# Altium schematic sheet PSDT Controller v1.0.0.SchDoc: Probe-Scope Digital Test: Controller
size Tabloid; CompanyName: Probe-Scope; Organization: Probe-Scope; Address1: Probe-Scope: Unified USB; Address2: Oscilloscope Probe; Address3: ©2019 M. Omo, J. Rowley,; Address4: K. Hall, released under the; DocumentNumber: SCH0020; SheetNumber: 1; PageSetup: Record=PageOptions|CenterHorizontal=True|CenterVertical=True|PrintScale=0.96|XCorrection=1.00|YCorrection=1.00|PrintKind=1|BorderSize=5000000|LeftOffset=0|BottomOffset=0|Orientation=2|PaperLength=1000|PaperWidth=1000|Scale=100|PaperSource=7|PrintQuality=-4|MediaType=1|DitherType=10|PaperKind=11x17|PrintScaleMode=1; Assembly: ASP0020; License: CERN OHL v1.2
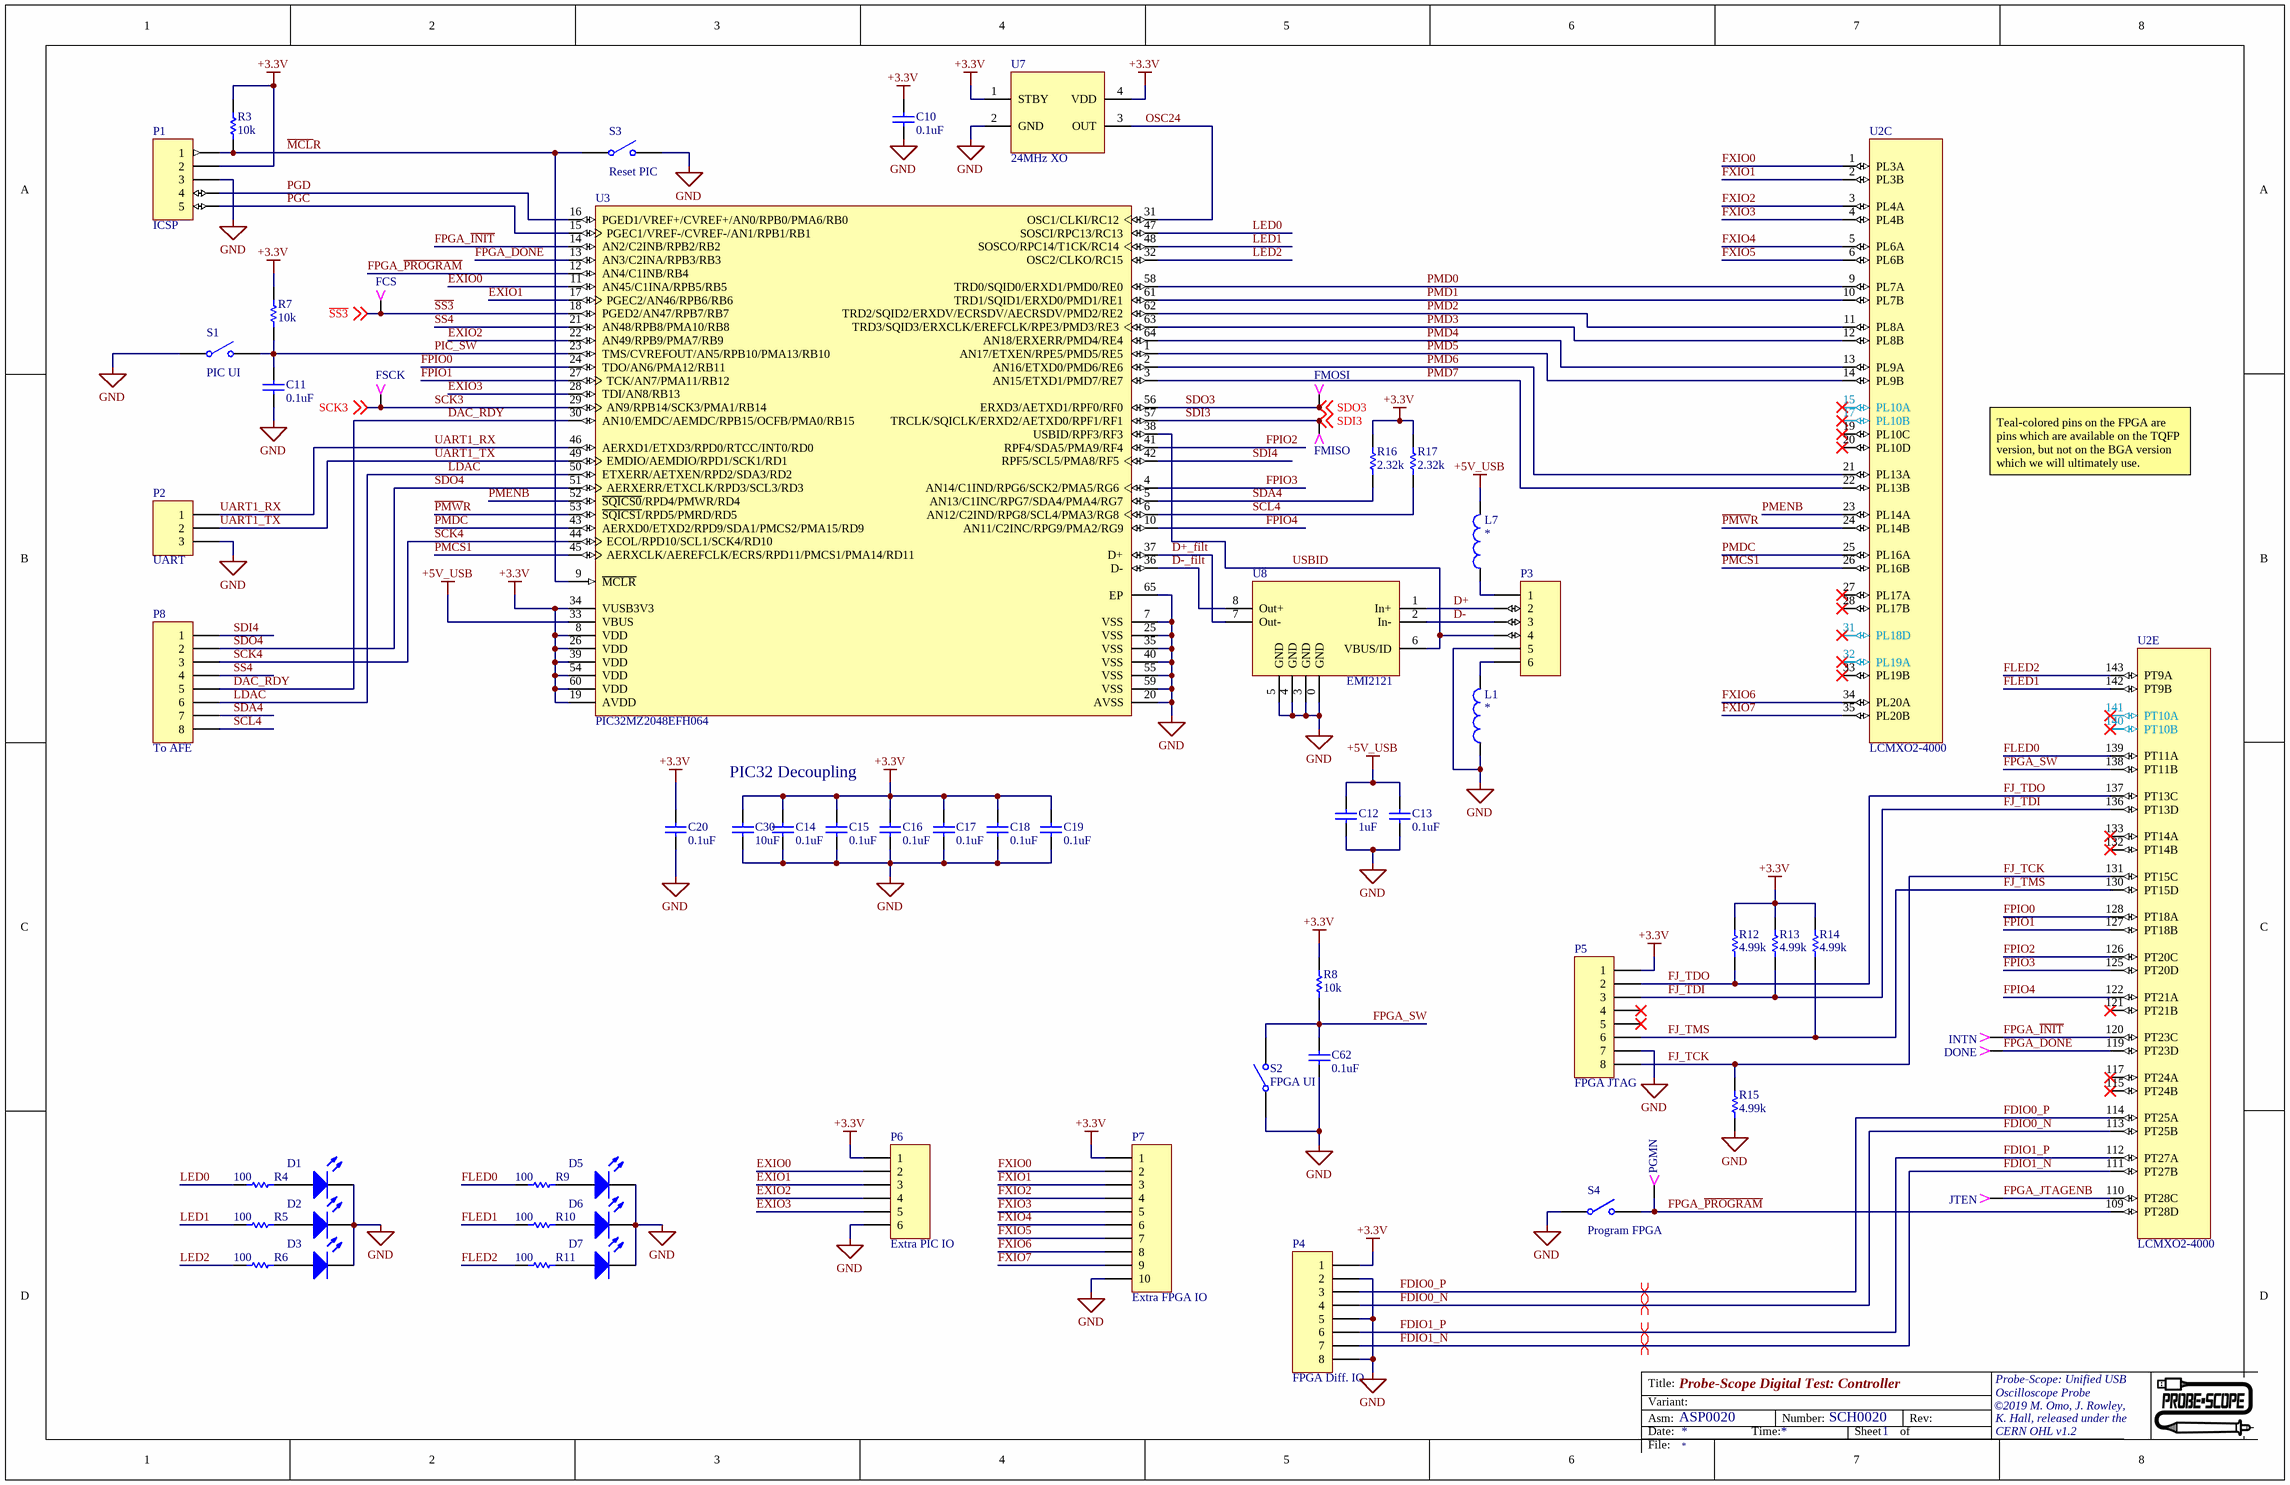
[diagram p0: PSDT Controller v1.0.0.SchDoc]

## Parts
C10  value 0.1uF  [0402(1005)]  (hidden comment: 6.3V)
C11  value 0.1uF  [0402(1005)]  (hidden comment: 6.3V)
C12  value 1uF  [0402(1005)]  (hidden comment: 10V)
C13  value 0.1uF  [0402(1005)]  (hidden comment: 6.3V)
C14  value 0.1uF  [0402(1005)]  (hidden comment: 6.3V)
C15  value 0.1uF  [0402(1005)]  (hidden comment: 6.3V)
C16  value 0.1uF  [0402(1005)]  (hidden comment: 6.3V)
C17  value 0.1uF  [0402(1005)]  (hidden comment: 6.3V)
C18  value 0.1uF  [0402(1005)]  (hidden comment: 6.3V)
C19  value 0.1uF  [0402(1005)]  (hidden comment: 6.3V)
C20  value 0.1uF  [0402(1005)]  (hidden comment: 6.3V)
C30  value 10uF  [0603(1608)]  (hidden comment: 25V)
C62  value 0.1uF  [0402(1005)]  (hidden comment: 6.3V)
D1  Green  [0603(1608) LED]  (value not drawn)
D2  Green  [0603(1608) LED]  (value not drawn)
D3  Green  [0603(1608) LED]  (value not drawn)
D5  Green  [0603(1608) LED]  (value not drawn)
D6  Green  [0603(1608) LED]  (value not drawn)
D7  Green  [0603(1608) LED]  (value not drawn)
DONE  TP  [TESTPOINT024]  (value not drawn)
FCS  TP  [TESTPOINT024]  (value not drawn)
FMISO  TP  [TESTPOINT024]  (value not drawn)
FMOSI  TP  [TESTPOINT024]  (value not drawn)
FSCK  TP  [TESTPOINT024]  (value not drawn)
INTN  TP  [TESTPOINT024]  (value not drawn)
JTEN  TP  [TESTPOINT024]  (value not drawn)
L1  Ferrite Bead  [0402(1005)]  (value not drawn)
L7  Ferrite Bead  [0402(1005)]  (value not drawn)
P1  ICSP  [MOLEX PICOBLADE 5 POS]
P2  UART  [MOLEX PICOBLADE 3 POS]
P3  Micro USB  [USB Micro B ZX62]  (value not drawn)
P4  FPGA Diff. IO  [0.1HDR1X8P]
P5  FPGA JTAG  [0.1HDR1X8P]
P6  Extra PIC IO  [0.1HDR1X6P]
P7  Extra FPGA IO  [0.1HDR1X10P]
P8  To AFE  [0.1HDR1X8P]
PGMN  TP  [TESTPOINT024]  (value not drawn)
R3  value 10k  [0402(1005)]  (hidden comment: 0.1% 25ppm)
R4  value 100  [0402(1005)]  (hidden comment: Res1)
R5  value 100  [0402(1005)]  (hidden comment: Res1)
R6  value 100  [0402(1005)]  (hidden comment: Res1)
R7  value 10k  [0402(1005)]  (hidden comment: 0.1% 25ppm)
R8  value 10k  [0402(1005)]  (hidden comment: 0.1% 25ppm)
R9  value 100  [0402(1005)]  (hidden comment: Res1)
R10  value 100  [0402(1005)]  (hidden comment: Res1)
R11  value 100  [0402(1005)]  (hidden comment: Res1)
R12  value 4.99k  [0402(1005)]  (hidden comment: Res1)
R13  value 4.99k  [0402(1005)]  (hidden comment: Res1)
R14  value 4.99k  [0402(1005)]  (hidden comment: Res1)
R15  value 4.99k  [0402(1005)]  (hidden comment: Res1)
R16  value 2.32k  [0402(1005)]  (hidden comment: Res1)
R17  value 2.32k  [0402(1005)]  (hidden comment: Res1)
S1  PIC UI  [PTS645 SMT]
S2  FPGA UI  [PTS645 SMT]
S3  Reset PIC  [PTS645 SMT]
S4  Program FPGA  [PTS645 SMT]
U2  LCMXO2-4000  [UL_TQFP144]  (parts C,E of 5)
U3  PIC32MZ2048EFH064  [QFN50P900X900-64N]
U7  24MHz XO  [DSC60xxC]
U8  EMI2121  [EMI2121]

## Nets
+3.3V: C10.2 C14.2 C15.2 C16.2 C17.2 C18.2 C19.2 C20.2 C30.2 P1.2 P4.1 P5.1 P6.1 P7.1 R3.2 R7.1 R8.1 R12.2 R13.2 R14.2 R16.2 R17.2 U3.8(VDD) U3.19(AVDD) U3.26(VDD) U3.34(VUSB3V3) U3.39(VDD) U3.54(VDD) U3.60(VDD) U7.1(STBY) U7.4(VDD)
+5V_USB: C12.2 C13.2 L7.2 U3.33(VBUS)
GND: C10.1 C11.1 C12.1 C13.1 C14.1 C15.1 C16.1 C17.1 C18.1 C19.1 C20.1 C30.1 C62.1 D1.2(K) D2.2(K) D3.2(K) D5.2(K) D6.2(K) D7.2(K) L1.1 P1.3 P2.3 P3.5 P4.2 P4.5 P4.8 P5.7 P6.6 P7.10 R15.1 S1.1(COMMON) S2.1(COMMON) S3.2(NO) S4.1(COMMON) U3.7(VSS) U3.20(AVSS) U3.25(VSS) U3.35(VSS) U3.40(VSS) U3.55(VSS) U3.59(VSS) U3.65(EP) U7.2(GND) U8.0(GND) U8.3(GND) U8.4(GND) U8.5(GND)
~{MCL}R: P1.1 R3.1 S3.1(COMMON) U3.9(~{MCLR})
~{PMW}R: U2.24(PL14B) U3.53(~{SQICS1}/RPD5/PMRD/RD5)
D+: P3.2 U8.1(In+)
D+_filt: U3.37(D+) U8.7(Out-)
D-: P3.3 U8.2(In-)
D-_filt: U3.36(D-) U8.8(Out+)
DAC_RDY: P8.5 U3.30(AN10/EMDC/AEMDC/RPB15/OCFB/PMA0/RB15)
EXIO0: P6.2 U3.11(AN45/C1INA/RPB5/RB5)
EXIO1: P6.3 U3.17(PGEC2/AN46/RPB6/RB6)
EXIO2: P6.4 U3.22(AN49/RPB9/PMA7/RB9)
EXIO3: P6.5 U3.28(TDI/AN8/RB13)
FDIO0_N: P4.4 U2.113(PT25B)
FDIO0_P: P4.3 U2.114(PT25A)
FDIO1_N: P4.7 U2.111(PT27B)
FDIO1_P: P4.6 U2.112(PT27A)
FJ_TCK: P5.8 R15.2 U2.131(PT15C)
FJ_TDI: P5.3 R13.1 U2.136(PT13D)
FJ_TDO: P5.2 R12.1 U2.137(PT13C)
FJ_TMS: P5.6 R14.1 U2.130(PT15D)
FLED0: R9.1 U2.139(PT11A)
FLED1: R10.1 U2.142(PT9B)
FLED2: R11.1 U2.143(PT9A)
FPGA_DONE: DONE.1 U2.119(PT23D) U3.13(AN3/C2INA/RPB3/RB3)
FPGA_~{INIT}: INTN.1 U2.120(PT23C) U3.14(AN2/C2INB/RPB2/RB2)
FPGA_JTAGENB: JTEN.1 U2.110(PT28C)
FPGA_~{PROGRAM}: PGMN.1 S4.2(NO) U2.109(PT28D) U3.12(AN4/C1INB/RB4)
FPGA_SW: C62.2 R8.2 S2.2(NO) U2.138(PT11B)
FPIO0: U2.128(PT18A) U3.24(TDO/AN6/PMA12/RB11)
FPIO1: U2.127(PT18B) U3.27(TCK/AN7/PMA11/RB12)
FPIO2: U2.126(PT20C) U3.41(RPF4/SDA5/PMA9/RF4)
FPIO3: U2.125(PT20D) U3.4(AN14/C1IND/RPG6/SCK2/PMA5/RG6)
FPIO4: U2.122(PT21A) U3.10(AN11/C2INC/RPG9/PMA2/RG9)
FXIO0: P7.2 U2.1(PL3A)
FXIO1: P7.3 U2.2(PL3B)
FXIO2: P7.4 U2.3(PL4A)
FXIO3: P7.5 U2.4(PL4B)
FXIO4: P7.6 U2.5(PL6A)
FXIO5: P7.7 U2.6(PL6B)
FXIO6: P7.8 U2.34(PL20A)
FXIO7: P7.9 U2.35(PL20B)
~{LDAC}: P8.6 U3.50(ETXERR/AETXEN/RPD2/SDA3/RD2)
LED0: R4.1 U3.47(SOSCI/RPC13/RC13)
LED1: R5.1 U3.48(SOSCO/RPC14/T1CK/RC14)
LED2: R6.1 U3.32(OSC2/CLKO/RC15)
OSC24: U3.31(OSC1/CLKI/RC12) U7.3(OUT)
PGC: P1.5 U3.15(PGEC1/VREF-/CVREF-/AN1/RPB1/RB1)
PGD: P1.4 U3.16(PGED1/VREF+/CVREF+/AN0/RPB0/PMA6/RB0)
PIC_SW: C11.2 R7.2 S1.2(NO) U3.23(TMS/CVREFOUT/AN5/RPB10/PMA13/RB10)
PMCS1: U2.26(PL16B) U3.45(AERXCLK/AEREFCLK/ECRS/RPD11/PMCS1/PMA14/RD11)
PMD0: U2.9(PL7A) U3.58(TRD0/SQID0/ERXD1/PMD0/RE0)
PMD1: U2.10(PL7B) U3.61(TRD1/SQID1/ERXD0/PMD1/RE1)
PMD2: U2.11(PL8A) U3.62(TRD2/SQID2/ERXDV/ECRSDV/AECRSDV/PMD2/RE2)
PMD3: U2.12(PL8B) U3.63(TRD3/SQID3/ERXCLK/EREFCLK/RPE3/PMD3/RE3)
PMD4: U2.13(PL9A) U3.64(AN18/ERXERR/PMD4/RE4)
PMD5: U2.14(PL9B) U3.1(AN17/ETXEN/RPE5/PMD5/RE5)
PMD6: U2.21(PL13A) U3.2(AN16/ETXD0/PMD6/RE6)
PMD7: U2.22(PL13B) U3.3(AN15/ETXD1/PMD7/RE7)
PMDC: U2.25(PL16A) U3.43(AERXD0/ETXD2/RPD9/SDA1/PMCS2/PMA15/RD9)
PMENB: U2.23(PL14A) U3.52(~{SQICS0}/RPD4/PMWR/RD4)
~{SS3}: FCS.1 U3.18(PGED2/AN47/RPB7/RB7) ; off-sheet ~{SS3}
~{SS4}: P8.4 U3.21(AN48/RPB8/PMA10/RB8)
SCK3: FSCK.1 U3.29(AN9/RPB14/SCK3/PMA1/RB14) ; off-sheet SCK3
SCK4: P8.3 U3.44(ECOL/RPD10/SCL1/SCK4/RD10)
SCL4: P8.8 R17.1 U3.6(AN12/C2IND/RPG8/SCL4/PMA3/RG8)
SDA4: P8.7 R16.1 U3.5(AN13/C1INC/RPG7/SDA4/PMA4/RG7)
SDI3: FMISO.1 U3.57(TRCLK/SQICLK/ERXD2/AETXD0/RPF1/RF1) ; off-sheet SDI3
SDI4: P8.1 U3.42(RPF5/SCL5/PMA8/RF5)
SDO3: FMOSI.1 U3.56(ERXD3/AETXD1/RPF0/RF0) ; off-sheet SDO3
SDO4: P8.2 U3.51(AERXERR/ETXCLK/RPD3/SCL3/RD3)
UART1_RX: P2.1 U3.46(AERXD1/ETXD3/RPD0/RTCC/INT0/RD0)
UART1_TX: P2.2 U3.49(EMDIO/AEMDIO/RPD1/SCK1/RD1)
USBID: P3.4 U3.38(USBID/RPF3/RF3) U8.6(VBUS/ID)
NetD1_1: D1.1(A) R4.2
NetD2_1: D2.1(A) R5.2
NetD3_1: D3.1(A) R6.2
NetD5_1: D5.1(A) R9.2
NetD6_1: D6.1(A) R10.2
NetD7_1: D7.1(A) R11.2
NetL1_2: L1.2 P3.6
NetL7_1: L7.1 P3.1

Not connected (* = marked no-connect by the designer): P5 4* 5*; U2 15(PL10A)* 17(PL10B)* 19(PL10C)* 20(PL10D)* 27(PL17A)* 28(PL17B)* 31(PL18D)* 32(PL19A)* 33(PL19B)* 115(PT24B)* 117(PT24A)* 121(PT21B)* 132(PT14B)* 133(PT14A)* 140(PT10B)* 141(PT10A)*

## Layout directives
differential pair: FDIO0_N, FDIO0_P, FDIO1_N, FDIO1_P

## Notes on the sheet
- Teal-colored pins on the FPGA are pins which are available on the TQFP version, but not on the BGA version which we will ultimately use.
- PIC32 Decoupling
- Title:
- Asm:
- Date:
- Variant:
- Time:
- Number:
- Sheet
- of
- Rev:
- File:

## Library data of the parts
C10 C11 C13-C20 C62 = 1875: Key: 1875; MENG_PN: ???1875; MANF: Samsung Electro-Mechanics; MANF_PN: CL05B104KQ5NNNC; VENDOR: Digikey; VENDOR_PN: 1276-1511-1-ND; P&V Description: Capacitor, Ceramic, 0.1uF, 6.3V, 10% Tol, 125C, X7R, 0402, SMD; Class: Capacitor; Type: Ceramic; Other: X7R; Tolerance: 10; Voltage: 6.3; Max Temperature: 125; Approved: False; Package: 0402; SMD: True; Date Modified: 11/6/2018 11:14:02 AM; Modified By: jrowley; Parent Key: 1875; Verified: False
C12 = 1876: Key: 1876; MENG_PN: ???1876; MANF: Murata Electronics; MANF_PN: GCM155C71A105KE38D; VENDOR: Digikey; VENDOR_PN: 490-13409-1-ND; P&V Description: Capacitor, Ceramic, 1uF, 10V, 10% Tol, 125C, X7S, 0402, SMD; Class: Capacitor; Type: Ceramic; Other: X7S; Tolerance: 10; Max Temperature: 125; Approved: False; Package: 0402; SMD: True; Date Modified: 11/6/2018 11:19:13 AM; Modified By: jrowley; Voltage: 10; Parent Key: 1876; Verified: False
C30 = 1306: Key: 1306; MENG_PN: ???1306; MANF: Samsung Electro-Mechanics; MANF_PN: CL10A106MA8NRNC; VENDOR: Digikey; VENDOR_PN: 1276-1869-1-ND; P&V Description: Capacitor, Ceramic, 10uF, 25V, 20% Tol, 85C, X5R, 0603, SMD; Class: Capacitor; Type: Ceramic; Other: X5R; Tolerance: 20; Voltage: 25; Max Temperature: 85; Approved: True; Package: 0603; SMD: True; Date Modified: 3/3/2015 11:08:29 AM; Modified By: sotterbacher; Parent Key: 1306; Verified: True
D1-D3 D5-D7 = 798: Key: 798; MENG_PN: ???798; MANF: OSRAM; MANF_PN: LG L29K-F2J1-24; VENDOR: Digikey; VENDOR_PN: 475-1193-1-ND; P&V Description: LED, 1.7V, 0.02A, Green, 570nm, diffused, 0603, SMD; Class: LED; Other: Green, 570nm, diffused; Voltage: 1.7; Current: 0.02; Approved: True; Package: 0603; SMD: True; Date Modified: 11/4/2014 3:14:11 PM; Modified By: pmarcus; Parent Key: 798; Verified: True
DONE FCS FMISO FMOSI FSCK INTN JTEN PGMN = 49: Key: 49; MENG_PN: CON00002; MANF: Keystone Electronics; MANF_PN: 1998-3; VENDOR: Digikey; VENDOR_PN: 1998-3K-ND; P&V Description: Connector, Test Point, 1 Positions, Male, Small, 0.27" Straight Pin, 0.02" dia; Class: Connector; Other: Small, 0.27" Straight Pin, 0.02" dia; Approved: True; Positions: 1; Sex: Male; Type: Test Point; SMD: False; Date Modified: 9/30/2014 10:31:54 AM; Parent Key: 49; Verified: True; Modified By: sotterbacher
L1 L7 = 1818: Key: 1818; MENG_PN: ???1818; MANF: Murata; MANF_PN: BLM15PX331SN1D; VENDOR: Digikey; VENDOR_PN: 490-11022-1-ND; P&V Description: Inductor, Ferrite Bead, 1.2A, 330 Ohm at 100MHz, 0402, SMD; Other: 330 Ohm at 100MHz; Current: 1.2; Approved: False; Value: *; Class: Inductor; Type: Ferrite Bead; Package: 0402; SMD: True; Date Modified: 8/28/2018 10:47:21 PM; Modified By: jrowley; Parent Key: 1818; Verified: False
P1 = 1316: Key: 1316; MENG_PN: ???1316; MANF: Molex; MANF_PN: 53047-0510; VENDOR: Digikey; VENDOR_PN: WM1734-ND; P&V Description: Connector, PicoBlade, 5 Positions, Male, 0.049" Spacing, 1A, 125V, Vert, Through Hole, Locking, Tin; Class: Connector; Other: Vert, Through Hole, Locking, Tin; Current: 1; Voltage: 125; Positions: 5; Spacing: 0.049; Sex: Male; Approved: True; Type: PicoBlade; SMD: False; Date Modified: 4/3/2015 6:22:35 PM; Modified By: pmarcus; Parent Key: 1316; Verified: True
P2 = 1286: Key: 1286; MENG_PN: ???1286; MANF: Molex; MANF_PN: 53047-0310; VENDOR: Digikey; VENDOR_PN: WM1732-ND; P&V Description: Connector, PicoBlade, 3 Positions, Male, 0.049" Spacing, 1A, 125V, Vert, Through Hole, Locking, Tin; Class: Connector; Other: Vert, Through Hole, Locking, Tin; Current: 1; Voltage: 125; Positions: 3; Spacing: 0.049; Sex: Male; Approved: True; Type: PicoBlade; SMD: False; Date Modified: 2/19/2015 4:08:35 PM; Modified By: rlaity; Parent Key: 1286; Verified: True
P3 = 1830: Key: 1830; MENG_PN: ???1830; MANF: Amphenol FCI; MANF_PN: 10118192-0002LF; VENDOR: Digikey; VENDOR_PN: 609-5379-1-ND; P&V Description: Connector, USB, 5 Positions, Female, 0.026" Spacing, 1.8A, 100V, USB - micro B USB 2.0 Receptacle Connector 5 Position Surface Mount, Right Angle, Without Flange, SMD; Class: Connector; Other: USB - micro B USB 2.0 Receptacle Connector 5 Position Surface Mount, Right Angle, Without Flange; Positions: 5; Sex: Female; Approved: False; Current: 1.8; Voltage: 100; Spacing: 0.026; Type: USB; SMD: True; Date Modified: 8/31/2018 2:15:27 PM; Modified By: jrowley; Parent Key: 1830; Verified: False
P4 P5 P8 = 152: Key: 152; MENG_PN: CON00027; MANF: Molex; VENDOR: Digikey; VENDOR_PN: WM2706-ND; P&V Description: Connector, Header, 0.1", 8 Positions, Male, 0.1" Spacing, 4A, 250V, Vertical, 0.24" Long, 0.125" Tail, 15u" Select Gold, Polarized, Locking Ramp; Class: Connector; Other: Vertical, 0.24" Long, 0.125" Tail, 15u" Select Gold, Polarized, Locking Ramp; Current: 4; Voltage: 250; Positions: 8; Spacing: 0.1; Sex: Male; Approved: False; MANF_PN: 22-11-2082; Type: Header, 0.1"; SMD: False; Date Modified: 7/21/2017 2:27:29 PM; Modified By: jrowley; Parent Key: 152; Verified: False
P6 = 51: Key: 51; MENG_PN: CON00013; MANF: Molex; VENDOR: Digikey; VENDOR_PN: WM2704-ND; P&V Description: Connector, Header, 0.1", 6 Positions, Male, 0.1" Spacing, 4A, 250V, 0.24" Long, 0.125" Tail, 15u" Select Gold, Polarized, Locking Ramp, Vertical; Class: Connector; Other: 0.24" Long, 0.125" Tail, 15u" Select Gold, Polarized, Locking Ramp, Vertical; Current: 4; Voltage: 250; Positions: 6; Spacing: 0.1; Sex: Male; Approved: False; MANF_PN: 22-11-2062; Type: Header, 0.1"; SMD: False; Date Modified: 7/21/2017 2:26:33 PM; Modified By: jrowley; Parent Key: 51; Verified: False
P7 = 275: Key: 275; MENG_PN: CON00037; MANF: Molex; VENDOR: Digikey; VENDOR_PN: WM2708-ND; P&V Description: Connector, Header, 0.1", 10 Positions, Male, 0.1" Spacing, 4A, 250V, Vertical, 0.24" Long, 0.125" Tail, 15u" Select Gold, Polarized, Locking Ramp; Class: Connector; Other: Vertical, 0.24" Long, 0.125" Tail, 15u" Select Gold, Polarized, Locking Ramp; Current: 4; Voltage: 250; Positions: 10; Spacing: 0.1; Sex: Male; Approved: False; MANF_PN: 22-11-2102; Type: Header, 0.1"; SMD: False; Date Modified: 7/21/2017 2:28:18 PM; Modified By: jrowley; Parent Key: 275; Verified: False
R3 R7 R8 = 1806: KEY: 1806; MENG_PN: ???1806; MANF: Stackpole Electronics; MANF_PN: RMCF0402FT10K0; VENDOR: Digikey; VENDOR_PN: RMCF0402FT10K0CT-ND; P&V Description: Resistor, Thick Film, 10k Ohms, 0.0625W, 1% Tol, 100V, 0402, SMD; Class: Resistor; Tolerance: 1; Power: 0.0625; Voltage: 100; Approved: False; Type: Thick Film; Package: 0402; SMD: True; Date Modified: 8/27/2018 6:34:02 PM; Modified By: jrowley; Expr1026: 1806; Parent Key: 1806; Verified: False
R4-R6 R9-R11 = 1823: KEY: 1823; MENG_PN: ???1823; MANF: Yageo; MANF_PN: RC0402FR-07100RL; VENDOR: Digikey; VENDOR_PN: 311-100LRCT-ND; P&V Description: Resistor, Thick Film, 100 Ohms, 0.0625W, 1% Tol, 100V, 0402, SMD; Class: Resistor; Tolerance: 1; Power: 0.0625; Approved: False; Type: Thick Film; Package: 0402; SMD: True; Date Modified: 8/29/2018 2:46:23 AM; Modified By: jrowley; Voltage: 100; Expr1026: 1823; Parent Key: 1823; Verified: False
R12-R15 = 1871: Key: 1871; MENG_PN: ???1871; MANF: Yageo; MANF_PN: RC0402FR-074K99L; VENDOR: Digikey; VENDOR_PN: 311-4.99KLRCT-ND; P&V Description: Resistor, Thick Film, 4.99k Ohms, 0.063W, 1% Tol, RES SMD 4.99K OHM 1% 1/16W 0402, 0402, SMD; Class: Resistor; Other: RES SMD 4.99K OHM 1% 1/16W 0402; Tolerance: 1; Power: 0.063; Approved: False; Type: Thick Film; Package: 0402; SMD: True; Date Modified: 11/5/2018 1:44:43 PM; Modified By: khall; Expr1026: 1871; Parent Key: 1871; Verified: False
R16 R17 = 1892: Key: 1892; MANF: Stackpole Electronics; MANF_PN: RMCF0402FT2K32; VENDOR: Digikey; VENDOR_PN: RMCF0402FT2K32CT-ND; P&V Description: Resistor, Thick Film, 2.32k Ohms, 0.0625W, 1% Tol, 2.32 kOhms ±1% 0.063W, 1/16W Chip Resistor 0402 (1005 Metric) Automotive AEC-Q200 Thick Film, 0402, SMD; Class: Resistor; Other: 2.32 kOhms ±1% 0.063W, 1/16W Chip Resistor 0402 (1005 Metric) Automotive AEC-Q200 Thick Film; Tolerance: 1; Power: 0.0625; Approved: False; MENG_PN: 1892; Type: Thick Film; Package: 0402; SMD: True; Date Modified: 12/12/2018 9:31:20 AM; Modified By: khall; Expr1026: 1892; Parent Key: 1892; Verified: False
S1-S4 = 1672: Key: 1672; MENG_PN: ???1672; MANF: C&K Components; MANF_PN: PTS645SK50SMTR92 LFS; VENDOR: Digikey; VENDOR_PN: CKN9087CT-ND; P&V Description: Switch, Tactile, Top Actuated, 0.05A, 260 grams, No Pegs, No ESD, 6x6mm, SMD; Class: Switch; Other: Top Actuated, 0.05A, 260 grams, No Pegs, No ESD; Approved: False; Type: Tactile; Package: 6x6mm; SMD: True; Date Modified: 5/24/2018 2:12:47 PM; Modified By: jrowley; Parent Key: 1672; Verified: True
U2 = MachXO2-4000-TG144: MANF: Lattice Semiconductor Corporation; MANF_PN: LCMXO2-4000HC-4TG144C; VENDOR: DigiKey; VENDOR_PN: 220-1460-ND
U3 = PIC32MZ2048EFH064-I/PT: Microchip PIC32MZ EF Series 64-pin; VENDOR_PN: PIC32MZ2048EFH064-I/PT-ND; MANF: Microchip Technology; VENDOR: DigiKey; MANF_PN: PIC32MZ2048EFH064-I/PT
U7 = 2055: Key: 2055; MENG_PN: ???2055; MANF: Microchip; MANF_PN: DSC6011JI1A-024.0000; VENDOR: Digikey; VENDOR_PN: DSC6011JI1A-024.0000-ND; P&V Description: IC, Oscillator, 24MHz XO (Standard) CMOD Oscillator, 1.71-3.63V, Standby (Power Down), 4-SMD, SMD; Class: IC; Other: 24MHz XO (Standard) CMOD Oscillator, 1.71-3.63V, Standby (Power Down); Approved: False; Type: Oscillator; Package: 4-SMD; SMD: True; Date Modified: 6/13/2019 1:30:40 AM; Modified By: jrowley; Parent Key: 2055; Verified: False
U8 = 2056: Key: 2056; MENG_PN: ???2056; MANF: On Semiconductor; MANF_PN: EMI2121MTTAG; VENDOR: Digikey; VENDOR_PN: EMI2121MTTAGOSCT-ND; P&V Description: IC, Channel Protector, USB Common-Mode Filter and ESD Protection, WDFN-8, SMD; Class: IC; Other: USB Common-Mode Filter and ESD Protection; Approved: False; Type: Channel Protector; Package: WDFN-8; SMD: True; Date Modified: 6/13/2019 8:04:40 AM; Modified By: jrowley; Parent Key: 2056; Verified: False